# EAGLE schematic rcz80cpuv2 (EAGLE 9.6.2)
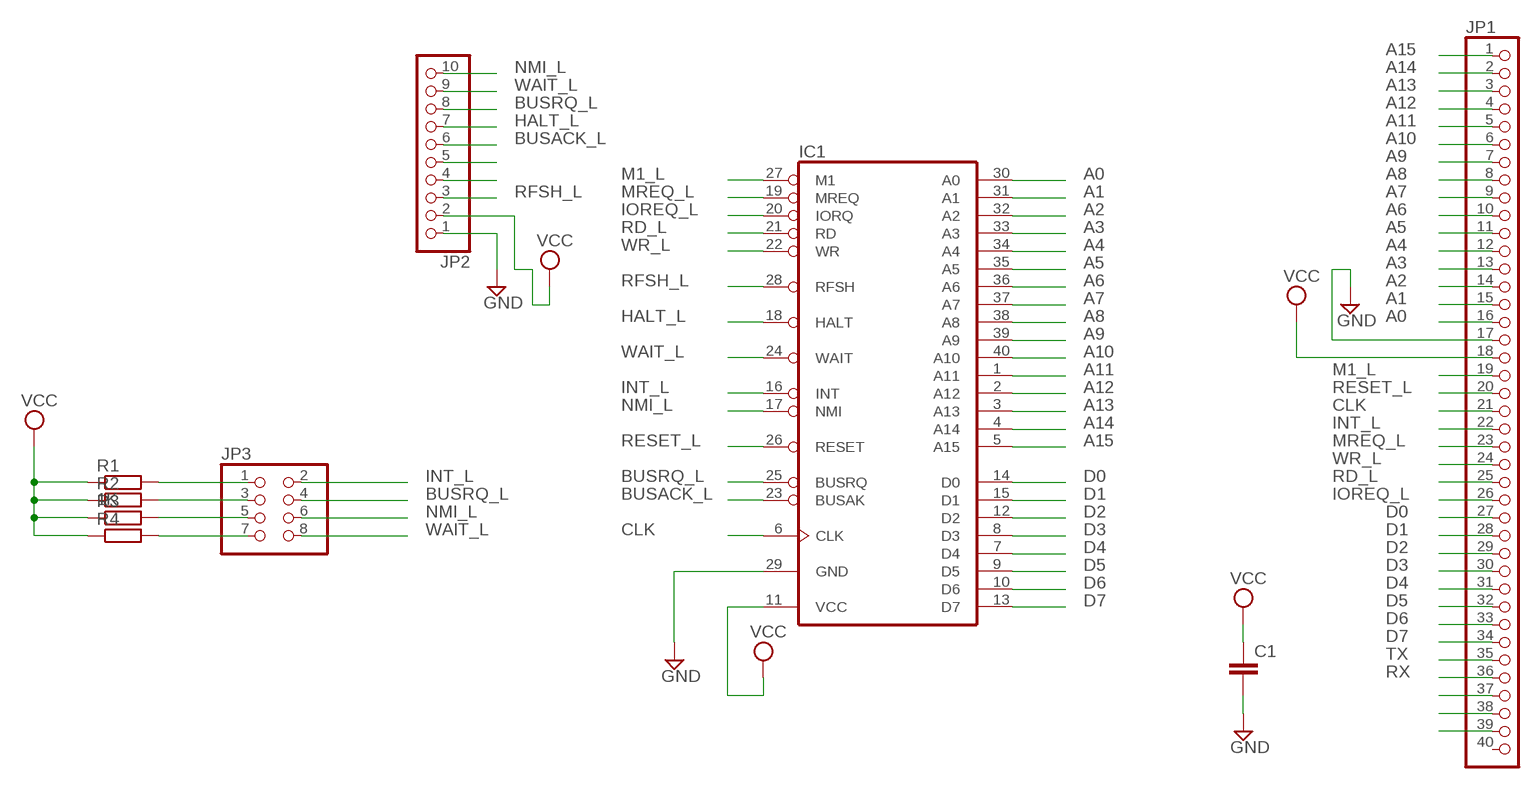
[diagram p0: schematic, sheet 1]

## Parts
C1  C-EU025-024X044  [C025-024X044]
IC1  Z80CPU  [DIL40]
JP1  PINHD-1X40  [1X40]
JP2  PINHD-1X10  [1X10]
JP3  PINHD-2X4  [2X04]
R1  1K  R-EU_0204/7  [0204/7]
R2  R-EU_0204/7  [0204/7]
R3  R-EU_0204/7  [0204/7]
R4  R-EU_0204/7  [0204/7]

## Nets
A0: IC1.30(A0) JP1.16
A1: IC1.31(A1) JP1.15
A2: IC1.32(A2) JP1.14
A3: IC1.33(A3) JP1.13
A4: IC1.34(A4) JP1.12
A5: IC1.35(A5) JP1.11
A6: IC1.36(A6) JP1.10
A7: IC1.37(A7) JP1.9
A8: IC1.38(A8) JP1.8
A9: IC1.39(A9) JP1.7
A10: IC1.40(A10) JP1.6
A11: IC1.1(A11) JP1.5
A12: IC1.2(A12) JP1.4
A13: IC1.3(A13) JP1.3
A14: IC1.4(A14) JP1.2
A15: IC1.5(A15) JP1.1
BUSACK_L: IC1.23(BUSAK) JP2.6
BUSRQ_L: IC1.25(BUSRQ) JP2.8 JP3.4
CLK: IC1.6(CLK) JP1.21
D0: IC1.14(D0) JP1.27
D1: IC1.15(D1) JP1.28
D2: IC1.12(D2) JP1.29
D3: IC1.8(D3) JP1.30
D4: IC1.7(D4) JP1.31
D5: IC1.9(D5) JP1.32
D6: IC1.10(D6) JP1.33
D7: IC1.13(D7) JP1.34
GND: C1.2 IC1.29(GND) JP1.17 JP2.1
HALT_L: IC1.18(HALT) JP2.7
INT_L: IC1.16(INT) JP1.22 JP3.2
IOREQ_L: IC1.20(IORQ) JP1.26
M1_L: IC1.27(M1) JP1.19
MREQ_L: IC1.19(MREQ) JP1.23
N$1: JP1.37
N$2: JP1.38
N$3: JP1.39
N$4: JP3.1 R1.2
N$5: JP3.3 R2.2
N$6: JP2.5
N$7: JP2.4
N$8: JP3.5 R3.2
N$9: JP3.7 R4.2
NMI_L: IC1.17(NMI) JP2.10 JP3.6
RD_L: IC1.21(RD) JP1.25
RESET_L: IC1.26(RESET) JP1.20
RFSH_L: IC1.28(RFSH) JP2.3
RX: JP1.36
TX: JP1.35
VCC: C1.1 IC1.11(VCC) JP1.18 JP2.2 R1.1 R2.1 R3.1 R4.1
WAIT_L: IC1.24(WAIT) JP2.9 JP3.8
WR_L: IC1.22(WR) JP1.24
Unconnected: JP1.40

## Library data of the parts
C1 = rcl:C-EU: CAPACITOR, European symbol; SPICEPREFIX: C
IC1 = zilog:Z80CPU: Z80 FAMILY DEVICE
JP1 = pinhead:PINHD-1X40: PIN HEADER
JP2 = pinhead:PINHD-1X10: PIN HEADER
JP3 = pinhead:PINHD-2X4: PIN HEADER
R1-R4 = rcl:R-EU_: RESISTOR, European symbol; SPICEPREFIX: R